# Altium schematic sheet tmf320f28388d_core_board_testpoint.SchDoc
size A3; SheetNumber: 5; SheetTotal: 5
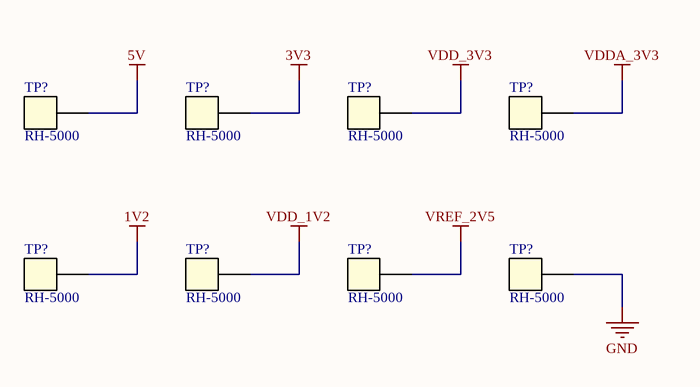
[diagram p0: tmf320f28388d_core_board_testpoint.SchDoc]

## Parts
(Parts that share a designator on the sheet are numbered #1, #2 ... from top to bottom, then left to right.)
TP?#1  RH-5000  [FP-5000-MFG]
TP?#2  RH-5000  [FP-5000-MFG]
TP?#3  RH-5000  [FP-5000-MFG]
TP?#4  RH-5000  [FP-5000-MFG]
TP?#5  RH-5000  [FP-5000-MFG]
TP?#6  RH-5000  [FP-5000-MFG]
TP?#7  RH-5000  [FP-5000-MFG]
TP?#8  RH-5000  [FP-5000-MFG]

## Nets
1V2: TP?#5.1
3V3: TP?#2.1
5V: TP?#1.1
GND: TP?#8.1
VDD_1V2: TP?#6.1
VDD_3V3: TP?#3.1
VDDA_3V3: TP?#4.1
VREF_2V5: TP?#7.1

## Library data of the parts
TP?#1-TP?#8 = RH-5000: PC TEST POINT MINIATURE RED; Outside Diameter: 2.54mm; Body Material: Bronze; Number of Contacts: 1; Insulation: Insulated; Inside Diameter: 1.27mm; Hole Diameter: 1.6mm; Plating: Silver; Length: 7.62mm; Package Quantity: 100; Number of Ports: 1; Contact Material: Bronze; Orientation: Straight; RoHS Compliant: Yes; Housing Color: Red; Height: 0.3inch; Series: THM; Lead Free: Lead Free; Color: Red; Contact Plating: Tin; Mount: PCB; Packaging: Bulk; REACH SVHC: No SVHC; Flammability Rating: UL94 V-0; Material: Nylon